# Altium schematic sheet DigitalMaze.SchDoc
size A4; SheetNumber: 1; SheetTotal: 1
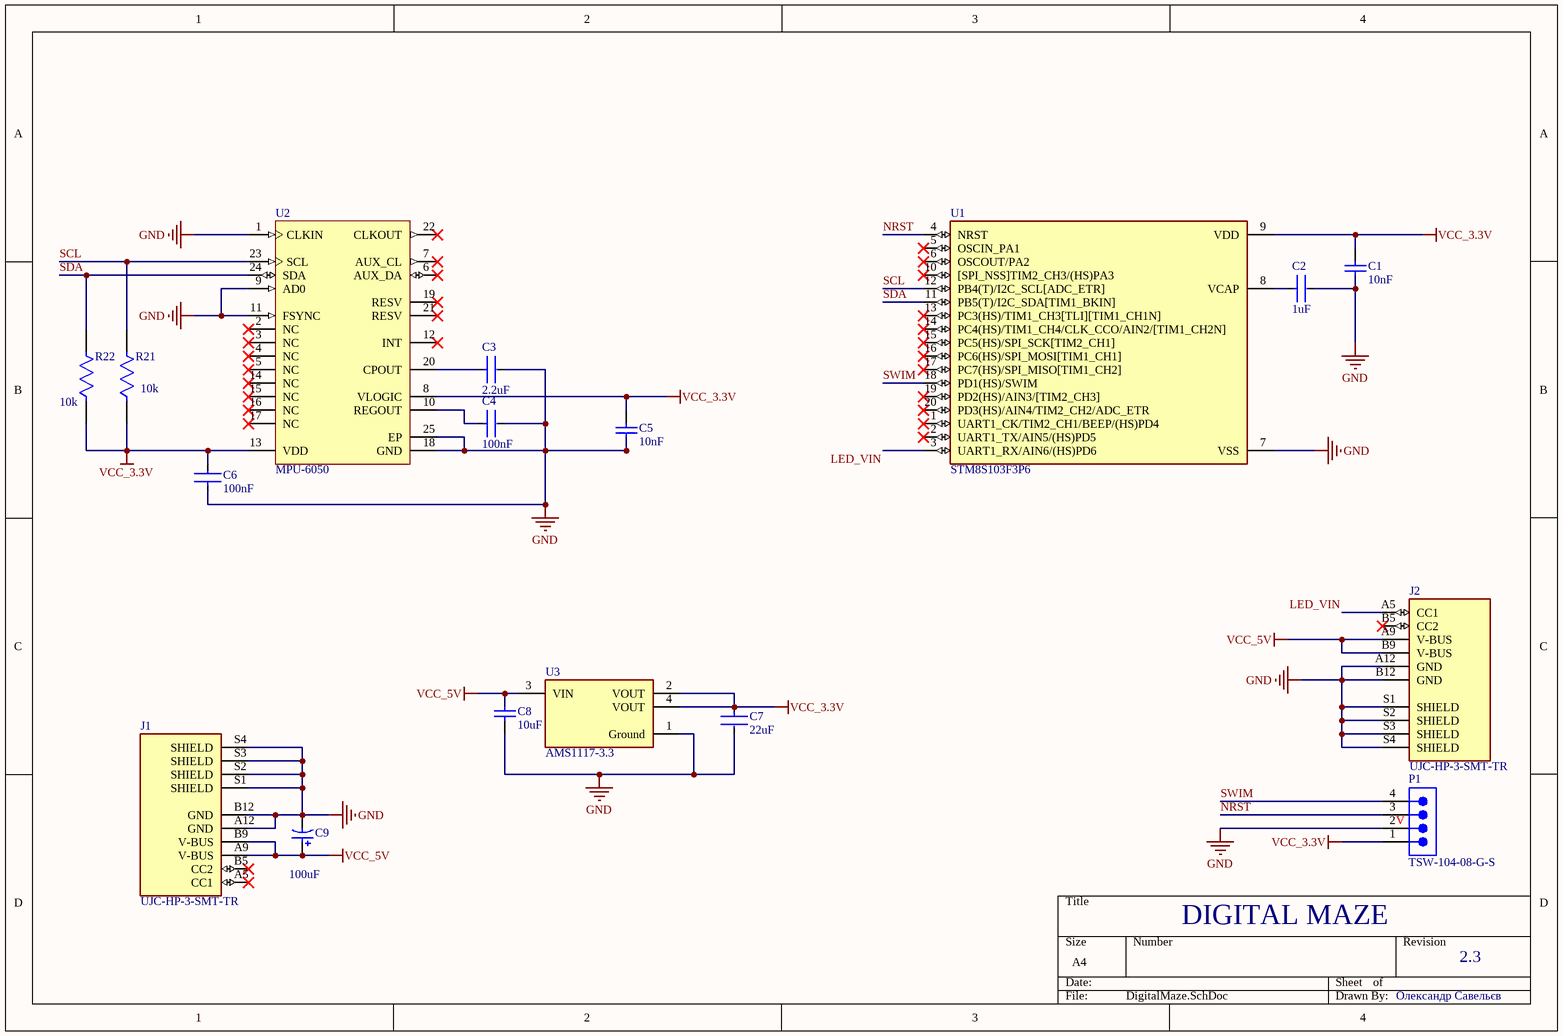
[diagram p0: DigitalMaze.SchDoc]

## Parts
C1  10nF  [CAPC1206(3216)150_N]
C2  1uF  [FP-CGA5L-0_3-0_1-MFG]
C3  2.2uF  [FP-1206-L_3_2_0_15-W_1_6-MFG]
C4  100nF  [FP-C1206C-EB-MFG]
C5  10nF  [CAPC1206(3216)150_N]
C6  100nF  [FP-C1206C-EB-MFG]
C7  22uF  [FP-GRM21B-0_2-e0_2_0_7-MFG]
C8  10uF  [CAPC1206(3216)190_N]
C9  100uF  [PNSC-FK-V-D8_V]
J1  UJC-HP-3-SMT-TR  [CUI_UJC-HP-3-SMT-TR]
J2  UJC-HP-3-SMT-TR  [CUI_UJC-HP-3-SMT-TR]
P1  TSW-104-08-G-S  [SMTC-TSW-104-08-X-S]
R21  10k  [FP-RT1206-MFG]
R22  10k  [FP-RT1206-MFG]
U1  STM8S103F3P6  [SOP65P640X120-20N]
U2  MPU-6050  [IS-QFN-24_V]
U3  AMS1117-3.3  [FP-AMS1117-IPC_C]

## Nets
GND: C1.1 C2.2 C3.2 C4.2 C5.1 C6.1 C7.2 C8.1 C9.2 J1.A12(GND) J1.B12(GND) J1.S1(SHIELD) J1.S2(SHIELD) J1.S3(SHIELD) J1.S4(SHIELD) J2.A12(GND) J2.B12(GND) J2.S1(SHIELD) J2.S2(SHIELD) J2.S3(SHIELD) J2.S4(SHIELD) P1.2 U1.7(VSS) U2.1(CLKIN) U2.9(AD0) U2.11(FSYNC) U2.18(GND) U2.25(EP) U3.1(Ground)
VCC_3.3V: C1.2 C5.2 C6.2 C7.1 P1.1 R21.1 R22.1 U1.9(VDD) U2.8(VLOGIC) U2.13(VDD) U3.2(VOUT) U3.4(VOUT)
VCC_5V: C8.2 C9.1 J1.A9(V-BUS) J1.B9(V-BUS) J2.A9(V-BUS) J2.B9(V-BUS) U3.3(VIN)
LED_VIN: J2.A5(CC1) U1.3(UART1_RX/AIN6/(HS)PD6)
NRST: P1.3 U1.4(NRST)
SCL: R21.2 U1.12(PB4(T)/I2C_SCL[ADC_ETR]) U2.23(SCL)
SDA: R22.2 U1.11(PB5(T)/I2C_SDA[TIM1_BKIN]) U2.24(SDA)
SWIM: P1.4 U1.18(PD1(HS)/SWIM)
NetC2_1: C2.1 U1.8(VCAP)
NetC3_1: C3.1 U2.20(CPOUT)
NetC4_1: C4.1 U2.10(REGOUT)

Not connected (* = marked no-connect by the designer): J1 A5(CC1)* B5(CC2)*; J2 B5(CC2)*; U1 1(UART1_CK/TIM2_CH1/BEEP/(HS)PD4)* 2(UART1_TX/AIN5/(HS)PD5)* 5(OSCIN_PA1)* 6(OSCOUT/PA2)* 10([SPI_NSS]TIM2_CH3/(HS)PA3)* 13(PC3(HS)/TIM1_CH3[TLI][TIM1_CH1N])* 14(PC4(HS)/TIM1_CH4/CLK_CCO/AIN2/[TIM1_CH2N])* 15(PC5(HS)/SPI_SCK[TIM2_CH1])* 16(PC6(HS)/SPI_MOSI[TIM1_CH1])* 17(PC7(HS)/SPI_MISO[TIM1_CH2])* 19(PD2(HS)/AIN3/[TIM2_CH3])* 20(PD3(HS)/AIN4/TIM2_CH2/ADC_ETR)*; U2 2(NC)* 3(NC)* 4(NC)* 5(NC)* 6(AUX_DA)* 7(AUX_CL)* 12(INT)* 14(NC)* 15(NC)* 16(NC)* 17(NC)* 19(RESV)* 21(RESV)* 22(CLKOUT)*

## Notes on the sheet
- DIGITAL MAZE
- 2.3
- Олександр Савельєв

## Library data of the parts
C1 C5 = CMP-1037-03492-1: CAP 10nF 25V ±10% 1206 (3216 Metric) Thickness 1.45mm SMD; Case-Metric: 3216; Tolerance: Â±10%; Case-EIA: 1206; Value: 10nF; Rated Voltage: 25 V; Technology: SMT; Max Thickness: 1.45 mm
C2 = CMP-08246-001699-1: Cap Ceramic 1uF 25V X7R 10% Pad SMD 1206 +125°C Automotive T/R; Max Operating Temperature: 125°C; Weight: 0.000571oz; Package Quantity: 2000; Width: 1.6mm; Voltage Rating: 25V; REACH SVHC: No SVHC; Height: 1.6mm; Min Operating Temperature: -55°C; Mount: Surface Mount; Case/Package: 1206; Ratings: AEC-Q200; Case Code (Imperial): 1206; Capacitance: 1uF; Termination: SMD/SMT; Length: 3.2mm; Depth: 1.6mm; Thickness: 0.075inch; Packaging: Tape and Reel; Tolerance: 10%; Dielectric: X7R; Case Code (Metric): 3216; Voltage Rating (DC): 25V; Composition: Ceramic
C3 = CMP-14477-002875-2: None; Voltage: 50V; Dielectric: X7R; Tolerance: 20%; Depth: 1.6mm; Max Operating Temperature: 125°C; Length: 3.2mm; RoHS Compliant: Yes; Min Operating Temperature: -55°C; Lead Free: Lead Free; Halogen Free: Halogen Free; Mount: Surface Mount; Height: 1.6mm; Capacitance: 2.2uF; Voltage Rating (DC): 50V
C4 C6 = CMP-03020-018297-1: C1206 0.10 μF U2J 20.00% 50 V; Manufacturer: KEMET; Manufacturer Part Number: C1206C104M5JACAUTO; Voltage Rating: 50 V; Automotive Grade: Grade 0; Capacitance: 0.10 μF; Value: 0.10 μF; Temperature Coefficient: 15%; Tolerance: 0.2; Material: Ceramic; Height: 0.88mm; Lead Free: Yes; ComponentLink2Description: Datasheet; ComponentLink2URL: https://content.kemet.com/datasheets/KEM_C1007_X8R_ULTRA_150C_SMD.pdf; Ipc Land Pattern Name: CAPC320160X78; Temperature Characteristic: U2J; RoHS: TRUE; Octopart: https://octopart.com/c1206c104m5jacauto-kemet-84732526; Package: C1206C-EB; Temperature Range Low: -55°C; Automotive: Yes; Temperature Range High: +150°C; Category: Cap; Device Class L3: Ceramic Capacitors; Device Class L2: Capacitors; Temperature: -55°C to +150°C; Device Class L1: Passive Components
C7 = CMP-06035-036790-1: Chip Multilayer Ceramic Capacitors for General Purpose, 0805, 22uF, X5R, 15%, 20%, 25V; Mount: Surface Mount; Voltage Rating: 25V; Capacitance: 22uF; Weight: 0.000335oz; Max Operating Temperature: 85°C; Dielectric: X5R; Length: 0.079inch; Voltage Rating (DC): 25V; Resistor Type: Ceramic; Package Quantity: 10000; Case Code (Imperial): 0805; Tolerance: 20%; Height: 1.25mm; Case/Package: 0805; Case Code (Metric): 2012; Min Operating Temperature: -55°C; Packaging: Tape and Reel; Thickness: 0.057inch; Width: 1.25mm; Termination: SMD/SMT
C8 = CMP-1037-04980-1: CAP 10uF 25V ±20% 1206 (3216 Metric) Thickness 1.9mm SMD; Case-EIA: 1206; Case-Metric: 3216; Tolerance: Â±20%; Value: 10uF; Rated Voltage: 25 V; Technology: SMT; Max Thickness: 1.9 mm
C9 = CMP-2000-06206-1: Aluminum Electrolytic Capacitor, 100 uF, +/- 20%, 25 V, 2-Pin SMD (Size Code D8), -55 to 105 degC, RoHS, Tape and Reel; Manufacturer: Panasonic; Type: Can; Lifetime@Temperature: 2000Hrs@105°C; Capacitance: 100µF; Rated Voltage: 25V; Ripple Current: 280mA; Impedance: 0.34O; Case Size/Dimension: Ø6.3x7.7mm; Operating Temp-Max: 105°C; Series: FK; Package URL: http://industrial.panasonic.com/cdbs/www-data/pdf/RDE0000/DME0000COL48.pdf; Mounting Technology: SurfaceMount; Package Description: 2-Pin Electrolytic Aluminum Capacitor, Body 6.6 x 6.6 mm; Datasheet Version: 03/2016; Datasheet URL: http://industrial.panasonic.com/cdbs/www-data/pdf/RDE0000/ABA0000C1181.pdf; Manufacturer URL: http://www.panasonic.com/; Package Reference: FK-V-D8; Operating Temp Range: -55to+105°C
P1 = CMP-1024-00357-1: 0.025" SQ Post Header, Through-hole, Vertical, -55 to 125 degC, 2.54 mm Pitch, 4-Pin, Male, RoHS; Manufacturer: Samtec; Pitch: 2.54 mm; RoHS: True; ComponentLink3URL: http://www.samtec.com/documents/webfiles/cpdf/TSW-XXX-XX-XXX-X-XX-XXX-MKT.pdf; Mounting Technology: Through-hole; ComponentLink2URL: http://www.samtec.com/documents/webfiles/pdf/TSW_TH.PDF; ComponentLink1URL: http://www.samtec.com; ComponentLink3Description: Package Specification; PackageVersion: DM, 8/1988; ComponentLink2Description: Datasheet; PackageReference: TSW-104-08-X-S; PackageDescription: .025[0.64] SQ. Post Terminal Strip Assembly; PartNumber: TSW-104-08-G-S; ComponentLink1Description: Manufacturer URL; Temperature Range: -55 to 125 degC; DatasheetVersion: F-214; Orientation: Vertical
R21 R22 = CMP-03412-025078-1: RES SMD 10K OHM 0.1% 1/4W 1206; Manufacturer: Yageo; Manufacturer Part Number: RT1206BRC0710KL; Voltage Rating: 200V; Resistance: 10KΩ; Temperature Coefficient: 15 ppm/°C; Power Rating: 0.25W; Tolerance: 0.005; Value: 10KΩ; Description: RT1206 10KΩ 0.25W 15 ppm/°C 0.50%; RoHS: TRUE; ComponentLink2Description: Datasheet; Ipc Land Pattern Name: RESC310160X55; Automotive: No; Series: RT; Octopart: https://octopart.com/rt1206brc0710kl-yageo-30512400; Device Class L1: Passive Components; Device Class L3: Chip SMD Resistors; Category: Res; Device Class L2: Resistors; Height: 0.65mm; Temperature: -55°C to +155°C; ComponentLink2URL: http://www.yageo.com/documents/recent/PYu-RT_1-to-0.01_RoHS_L_9.pdf; Package: RT1206; Lead Free: Yes; Composition: Thin Film; Temperature Range Low: -55°C; Footprint Url: http://www.yageo.com/exep/pages/download/literatures/PYu-R_Mount_10.pdf; Digikey Description: RES SMD 10K OHM 0.1% 1/4W 1206; Temperature Range High: +155°C
U1 = STM8S103F3P6: STM8 series Microcontroller IC 8-Bit 16MHz 8KB (8K x 8) FLASH 20-TSSOP; MF: STMicroelectronics; SnapEDA_Link: https://www.snapeda.com/parts/STM8S103F3P6/STMicroelectronics/view-part/?ref=snap; Package: TSSOP-20 STMicroelectronics; Value: *; MP: STM8S103F3P6; Check_prices: https://www.snapeda.com/parts/STM8S103F3P6/STMicroelectronics/view-part/?ref=eda
U2 = CMP-1753-00002-2: 3-Axis Gyroscope, Accelerometer and a Digital Motion Processor(TM) (DMP), 2.375 to 3.46 V, -40 to 85 degC, 24-Pin QFN, RoHS, Tape and Reel; Manufacturer: InvenSense; Featured Product: MPU-60506-Axis,IntegratedI²CSolution; Other Names: 1428-1007-2 / MPU6050; Sensor Type: MotionTracking; Online Catalog: MPU-6000™Series; Unit PriceUSD: Digital; Datasheet Version: Rev. 3.3, 05/2012; Category: Sensors,Transducers; Datasheet URL: http://datasheet.octopart.com/MPU-6050-InvenSense-datasheet-14421344.pdf; Family: Multifunction; Standard Package: 5,000; Manufacturer URL: http://www.invensense.com/; Output Type: Digital; Dynamic Catalog: MPU-6000™Series
U3 = CMP-209535-000001-1: LDO Voltage Regulators 1A, 3.3V; Manufacturer: Advanced Monolithic Systems; Dropout Voltage: 1.1V; Output Type: Fixed; Nominal Supply Current: 5mA; Max Power Dissipation: 1.2W; Max Supply Voltage: 15V; Number Of Outputs: 1; Standoff Height: 0.64mm; Max Junction Temp: +125°C; Height: 1.8mm; Package: AMS1117; Device Class L2: Power Management ICs; ComponentLink2Description: Datasheet; ComponentLink2URL: http://www.advanced-monolithic.com/pdf/ds1117.pdf; Category: IC; RoHS: TRUE; Automotive: No; Device Class L1: Integrated Circuits (ICs); Output Current: 1A; Device Class L3: Voltage Regulators - Linear; Temperature: -40°C to +125°C; Output Voltage: 3.3V; Manufacturer Part Number: AMS1117-3.3; Temperature Range Low: -40°C; Octopart: https://octopart.com/ams1117-3.3-advanced+monolithic+systems-25899300; Lead Free: Yes; Ipc Land Pattern Name: SOT229P700X180-4; Temperature Range High: +125°C
J1 J2 = UJC-HP-3-SMT-TR: Package: None; Price: None; Value: *; MP: UJC-HP-3-SMT-TR; Availability: Unavailable